# Altium schematic sheet FP6291 boost converter low power.SchDoc: FP6291 Boost converter
size A4; Date: 06.05.2016; Author: Pavel Nadein; DrawnBy: Pavel Nadein; Revision: P1A; DocumentName: FP6291 Boost converter
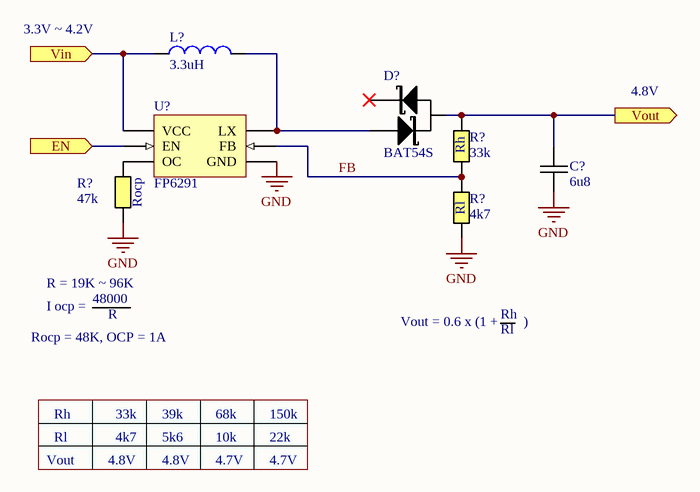
[diagram p0: FP6291 boost converter low power.SchDoc]

## Parts
(Parts that share a designator on the sheet are numbered #1, #2 ... from top to bottom, then left to right.)
C?  6u8  [CAPC0805(2012)75_N]
D?  BAT54S  [SOT23]
L?  3.3uH  [C_1206]
R?#1  33k  [RESC0603(1608)_N]
R?#2  47k  [RESC0603(1608)_N]
R?#3  4k7  [RESC0603(1608)_N]
U?  FP6291  [SOT23-6]

## Ports
EN (in), Vin (in), Vout (out)

## Nets
GND: C?.2 R?#2.1 R?#3.1 U?.2(GND)
EN: U?.4(EN) ; port EN
FB: R?#1.1 R?#3.2 U?.3(FB)
Vin: L?.1 U?.5(VCC) ; port Vin
Vout: C?.1 D?.3 R?#1.2 ; port Vout
NetD?_1: D?.1 L?.2 U?.1(LX)
NetR?#2_2: R?#2.2 U?.6(OC)

Not connected (* = marked no-connect by the designer): D? 2*

## Notes on the sheet
- 3.3V ~ 4.2V
- (near R?#1) Rh
- 4.8V
- (near R?#2) Rocp
- (near R?#3) Rl
- I ocp =
- R = 19K ~ 96K
- 48000
- Rocp = 48K, OCP = 1A
- R
- Vout = 0.6 x (1 +
- Rh
- Rl
- )
- Vout
- 33k
- 4k7
- 39k
- 5k6
- 4.7V
- 68k
- 10k
- 150k
- 22k

## Library data of the parts
C? = Capacitor M: Ceramic capacitor Medium density; Value: 6u8
D? = BAT54S-SOT323: DUAL SCHOTTKY DIODE SERIES; Manufacturer: NXP Semiconductors; Manufacturer Part Number: BAT54SW,115; Voltage - Forward (Vf) (Max) @ If: 800mV @ 100mA; Current - Reverse Leakage @ Vr: 2µA @ 25V; Speed: Small Signal =< 200mA (Io), Any Speed; Diode Configuration: 1 Pair Series Connection; Current - Average Rectified (Io) (per Diode): 200mA (DC); Voltage - DC Reverse (Vr) (Max): 30V; Reverse Recovery Time (trr): 5ns; Supplier 1: Digi-Key; Supplier Part Number 1: 568-1615-2-ND; Mounting Type: Surface Mount; Packaging: Tape & Reel (TR); Package / Case: SC-70-3, SOT-323-3; Diode Type: Schottky; Supplier Part Number: 568-1615-2-ND; Category: Discrete Semiconductor Products; Supplier: Digi-Key; RoHS: RoHS Compliant
L? = Inductor: Value: 3.3uH
R?#1-R?#3 = Resistor M: Resistor Medium Density
  R?#1: Value: 33k
  R?#2: Value: 47k
  R?#3: Value: 4k7
U? = FP6291: Current mode boost up converter; Vin: 2.6 ~ 5.5V; Freqency: 1MHz; Vref: 0.6V; Imax: 2A; Vout max: 12V